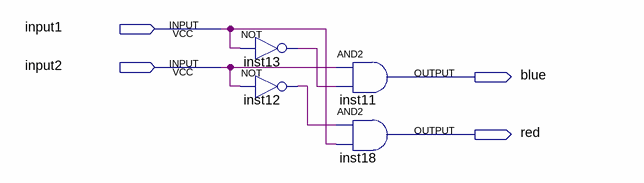
[diagram p0: schematic sheet]
// Quartus schematic red_blue.bdf as structural Verilog: 4 symbols, 4 pins
module red_blue (
  input  input1,
  input  input2,
  output blue,
  output red
);

  wire inst12_out, inst13_out;

  not inst13 (inst13_out, input1);
  not inst12 (inst12_out, input2);
  and inst11 (blue, input2, inst13_out);
  and inst18 (red, inst12_out, input1);
endmodule
